# EAGLE design i2c_bargraph (EAGLE 7.4.0)
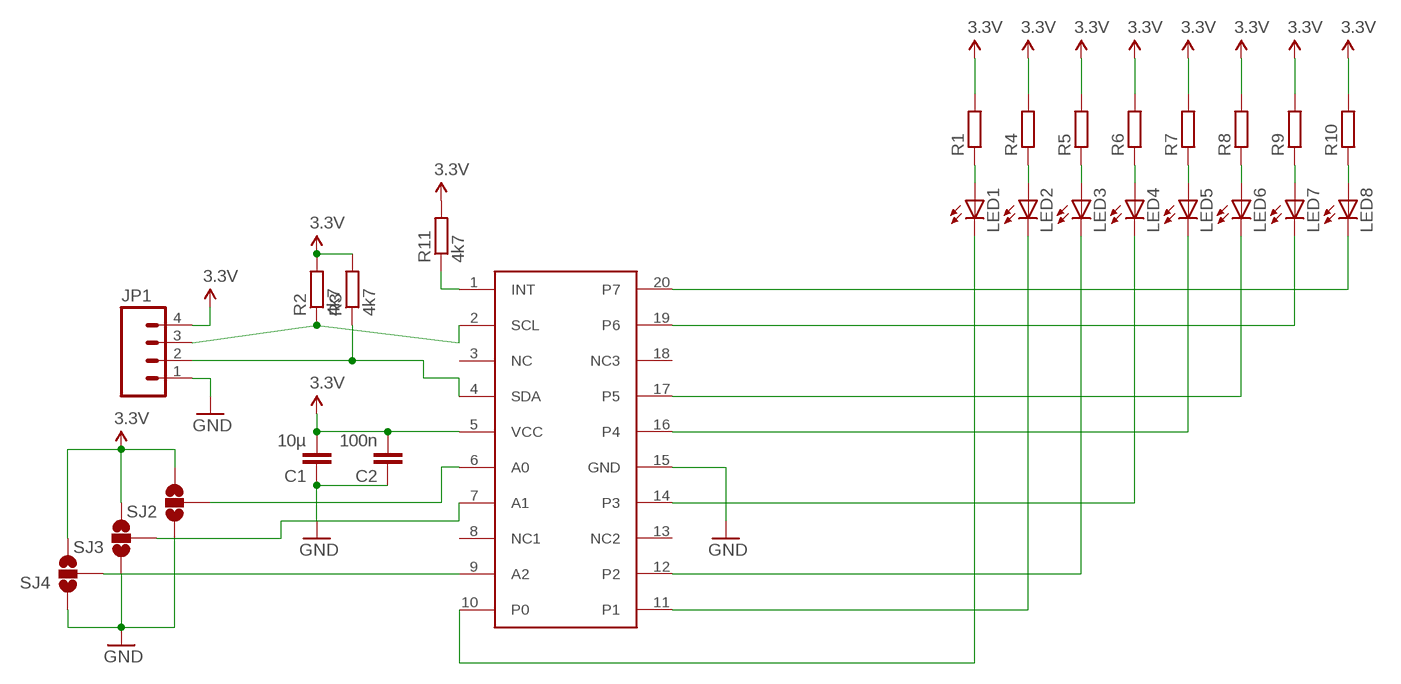
[diagram p0: schematic, sheet 1]

## Parts
C1  10µ  C-EUC0603  [C0603]
C2  100n  C-EUC0603  [C0603]
JP1  M04PTH  [1X04]
LED1  LEDCHIP-LED0805  [CHIP-LED0805]
LED2  LEDCHIP-LED0805  [CHIP-LED0805]
LED3  LEDCHIP-LED0805  [CHIP-LED0805]
LED4  LEDCHIP-LED0805  [CHIP-LED0805]
LED5  LEDCHIP-LED0805  [CHIP-LED0805]
LED6  LEDCHIP-LED0805  [CHIP-LED0805]
LED7  LEDCHIP-LED0805  [CHIP-LED0805]
LED8  LEDCHIP-LED0805  [CHIP-LED0805]
R1  R-EU_R0603  [R0603]
R2  4k7  R-EU_R0603  [R0603]
R3  4k7  R-EU_R0603  [R0603]
R4  R-EU_R0603  [R0603]
R5  R-EU_R0603  [R0603]
R6  R-EU_R0603  [R0603]
R7  R-EU_R0603  [R0603]
R8  R-EU_R0603  [R0603]
R9  R-EU_R0603  [R0603]
R10  R-EU_R0603  [R0603]
R11  4k7  R-EU_R0603  [R0603]
SJ2  SOLDERJUMPER_2WAY-OLDS  [SJ_3]
SJ3  SOLDERJUMPER_2WAY-OLDS  [SJ_3]
SJ4  SOLDERJUMPER_2WAY-OLDS  [SJ_3]
U$1  PCF8574TSSOP  [TSSOP20]

## Nets
3.3V: C1.2 C2.2 JP1.4 R1.2 R2.2 R3.2 R4.2 R5.2 R6.2 R7.2 R8.2 R9.2 R10.2 R11.2 SJ2.3 SJ3.3 SJ4.3 U$1.5(VCC)
GND: C1.1 C2.1 JP1.1 SJ2.1 SJ3.1 SJ4.1 U$1.15(GND)
N$1: JP1.3 R2.1 U$1.2(SCL)
N$2: JP1.2 R3.1 U$1.4(SDA)
N$3: R11.1 U$1.1(INT)
N$4: LED1.A R1.1
N$5: LED2.A R4.1
N$6: LED3.A R5.1
N$7: LED4.A R6.1
N$8: LED5.A R7.1
N$9: LED6.A R8.1
N$10: LED7.A R9.1
N$11: LED8.A R10.1
N$12: LED1.C U$1.10(P0)
N$13: LED2.C U$1.11(P1)
N$14: LED3.C U$1.12(P2)
N$15: LED4.C U$1.14(P3)
N$16: LED5.C U$1.16(P4)
N$17: LED6.C U$1.17(P5)
N$18: LED7.C U$1.19(P6)
N$19: LED8.C U$1.20(P7)
N$21: SJ4.2 U$1.9(A2)
N$22: SJ3.2 U$1.7(A1)
N$23: SJ2.2 U$1.6(A0)
Unconnected: U$1.3(NC) U$1.8(NC1) U$1.13(NC2) U$1.18(NC3)

## Library data of the parts
C1 C2 = rcl:C-EU: CAPACITOR, European symbol
JP1 = SparkFun-Connectors:M04: Header 4 Standard 4-pin 0.1" header. Use with straight break away headers (SKU : PRT-00116), right angle break away headers (PRT-00553), swiss pins (PRT-00743), machine pins (PRT-00117), and female headers (PRT-00115). Molex polarized connector foot print use with SKU : PRT-08231 with associated crimp pins and housings. 1MM SMD Version SKU: PRT-10208
LED1-LED8 = adafruit:LED: LED OSRAM: - CHIPLED LG R971, LG N971, LY N971, LG Q971, LY Q971, LO R971, LY R971 LH N974, LH R974 LS Q976, LO Q976, LY Q976 LO Q996 - Hyper CHIPLED LW Q18S LB Q993, LB Q99A, LB R99A - SideLED LS A670, LO A670, LY A670, LG A670, LP A670 LB A673, LV A673, LT A673, LW A673 LH A674 LY A675 LS A676, LA A676, LO A676, LY A676, LW A676 LS A679, LY A679, LG A679 - Hyper Micro SIDELED® LS Y876, LA Y876, LO Y876, LY Y876 LT Y87S - SmartLED LW L88C, LW L88S LB L89C, LB L89S, LG L890 LS L89K, LO L89K, LY L89K LS L896, LA L896, LO L896, LY L896 - TOPLED LS T670, LO T670, LY T670, LG T670, LP T670 LSG T670, LSP T670, LSY T670, LOP T670, LYG T670 LG T671, LOG T671, LSG T671 LB T673, LV T673, LT T673, LW T673 LH T674 LS T676, LA T676, LO T676, LY T676, LB T676, LH T676, LSB T676, LW T676 LB T67C, LV T67C, LT T67C, LS T67K, LO T67K, LY T67K, LW E67C LS E67B, LA E67B, LO E67B, LY E67B, LB E67C, LV E67C, LT E67C LW T67C LS T679, LY T679, LG T679 LS T770, LO T770, LY T770, LG T770, LP T770 LB T773, LV T773, LT T773, LW T773 LH T774 LS E675, LA E675, LY E675, LS T675 LS T776, LA T776, LO T776, LY T776, LB T776 LHGB T686 LT T68C, LB T68C - Hyper Mini TOPLED® LB M676 - Mini TOPLED Santana® LG M470 LS M47K, LO M47K, LY M47K Source: http://www.osram.convergy.de/
R1-R11 = rcl:R-EU_: RESISTOR, European symbol
SJ2-SJ4 = SparkFun-Retired:SOLDERJUMPER_2WAY-OLD: Solder Jumper 2 way solder jumper
U$1 = PFC8574Tssop:PCF8574TSSOP

## Board
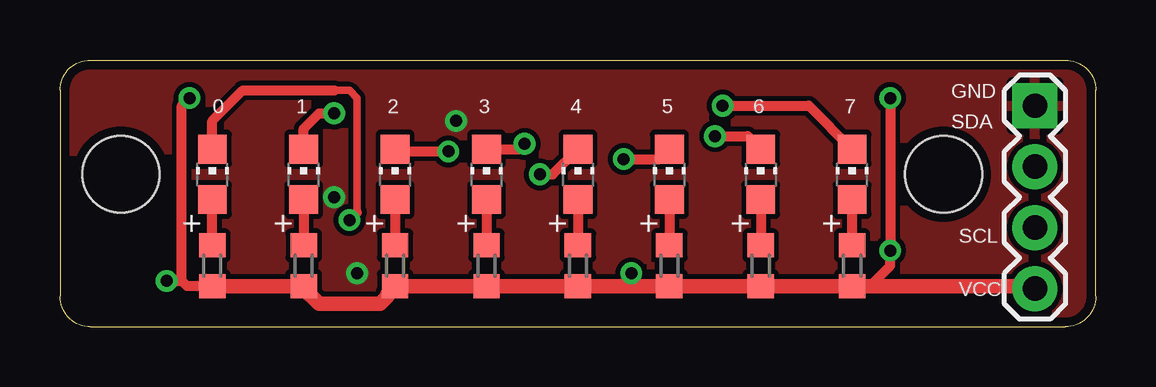
[diagram p1: board, top side]
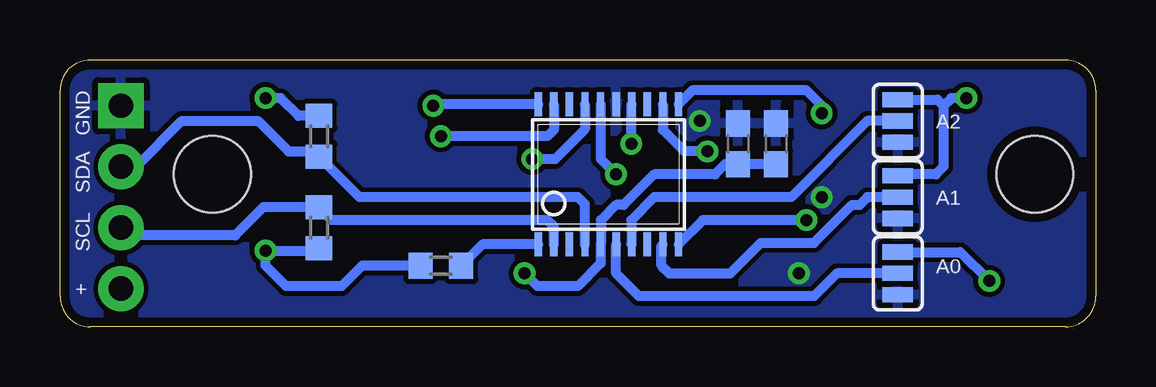
[diagram p2: board, bottom side, seen from below]

Size 43.18 x 11.11 mm. Coordinates in mm from the lower left corner, seen from the top.
Outline: 1.27,0 41.91,0 arc90 43.18,1.27 43.18,9.84 arc90 41.91,11.11 1.27,11.11 arc90 0,9.84 0,1.27 arc90 1.27,0
Copper layers (1*16): Top 0.035mm / dielectric 1.5mm / Bottom 0.035mm
Design rules "default *": minimum track width 10mil, minimum drill 24mil, track to track 8mil, track to pad 8mil, pad to pad 8mil, via to via 8mil, smd to smd 8mil, copper to edge 15mil, drill to drill 8mil, minimum pad ring 10mil, minimum via ring 8mil, stop-mask expansion 4mil, vias tented up to drill 20mil, thermal gap 10mil
Holes 3.2 mm at 2.54,6.35 36.83,6.35

### Footprints (pad centres in the part's own frame; a part is rotated, then mirrored left to right if it is on the bottom)
C0603 = smd 1.1 x 1: 1 -0.85,0; 2 0.85,0
1X04 = drill 1.016 pad 1.88 square: 1 0,0 | drill 1.016 pad 1.88: 2 2.54,0; 3 5.08,0; 4 7.62,0
CHIP-LED0805 = smd 1.2 x 1.2: A 0,-1.05; C 0,1.05
R0603 = smd 1 x 1.1: 1 -0.85,0; 2 0.85,0
SJ_3 = smd 0.635 x 1.27: 1 -0.889,0; 2 0,0; 3 0.889,0
TSSOP20 = smd 0.305 x 0.991: 1 -2.925,-2.918; 2 -2.275,-2.918; 3 -1.625,-2.918; 4 -0.975,-2.918; 5 -0.325,-2.918; 6 0.325,-2.918; 7 0.975,-2.918; 8 1.625,-2.918; 9 2.275,-2.918; 10 2.925,-2.918; 11 2.925,2.918; 12 2.275,2.918; 13 1.625,2.918; 14 0.975,2.918; 15 0.325,2.918; 16 -0.325,2.918; 17 -0.975,2.918; 18 -1.625,2.918; 19 -2.275,2.918; 20 -2.925,2.918

### Placement (x,y rotation side)
C1  14.92,7.62 270 bottom
C2  13.34,7.62 270 bottom
JP1  40.64,9.21 270 top
LED1  6.35,6.35 0 top
LED2  10.16,6.35 0 top
LED3  13.97,6.35 0 top
LED4  17.78,6.35 0 top
LED5  21.59,6.35 0 top
LED6  25.4,6.35 0 top
LED7  29.21,6.35 0 top
LED8  33.02,6.35 0 top
R1  6.35,2.54 270 top
R2  32.38,4.13 270 bottom
R3  32.38,7.94 90 bottom
R4  10.16,2.54 270 top
R5  13.97,2.54 270 top
R6  17.78,2.54 270 top
R7  21.59,2.54 270 top
R8  25.4,2.54 270 top
R9  29.21,2.54 270 top
R10  33.02,2.54 270 top
R11  27.3,2.54 180 bottom
SJ2  8.26,2.22 90 bottom
SJ3  8.26,8.57 90 bottom
SJ4  8.26,5.4 90 bottom
U$1  20.32,6.35 0 bottom

### Tracks (layer width: path | path; a pad name or v marks a point on that pad's centre or on a via)
3.3V  (via drill 0.5)
  Top 0.406: v34.61,9.53 v34.61,3.17 34.61,2.54 33.76,1.69 R10.2 | v23.81,2.22 23.81,1.69 | R1.2 5.29,1.69 5.08,1.91 | 5.08,1.91 5.08,9.21 v5.4,9.53 | v4.45,1.91 5.08,1.91
  Top 0.61: R1.2 R4.2 10.16,1.59 10.79,0.95 13.34,0.95 13.65,1.27 13.65,1.37 R5.2 R6.2 R7.2 23.81,1.69 R8.2 R9.2 R10.2 40.54,1.69 JP1.4
  Bottom 0.406: SJ3.3 6.6,9.46 6.35,9.21 | 6.35,9.21 6.35,6.67 6.67,6.35 8.19,6.35 SJ4.3 | SJ2.3 5.65,3.11 v4.45,1.91 | C1.2 C2.2 15.46,6.77 15.88,6.35 18.41,6.35 19.68,5.08 20,5.08 20.64,4.45 U$1.5 20.64,2.63 R7.2 23.28,1.69 v23.81,2.22 | R3.2 33.23,8.79 33.97,9.53 v34.61,9.53 | R2.2 32.49,3.17 v34.61,3.17 34.61,2.54 33.76,1.69 31.43,1.69 30.58,2.54 R11.2 | 6.35,9.21 6.03,9.53 v5.4,9.53
GND  (via drill 0.5)
  other vias: 16.51,8.57 11.43,5.4 12.38,2.22
  pour Top: -0.95,12.06 -0.95,-0.95 44.13,-0.95 44.13,12.06
  pour Bottom: -0.32,11.75 -0.32,-0.32 43.5,-0.32 43.5,11.75
N$1
  Bottom 0.406: U$1.2 22.59,4.18 22.86,4.45 31.85,4.45 R2.1 34.71,4.98 35.88,3.81 40.32,3.81 JP1.3
N$2
  Bottom 0.406: U$1.4 21.3,5.1 21.59,5.4 30.7,5.4 R3.1 32.6,7.3 33.65,7.3 34.92,8.57 38.1,8.57 40,6.67 JP1.2
N$3
  Bottom 0.406: U$1.1 25.56,3.43 R11.1
N$4
  Top 0.406: R1.1 LED1.A
N$5
  Top 0.406: LED2.A R4.1
N$6
  Top 0.406: LED3.A R5.1
N$7
  Top 0.406: LED4.A R6.1
N$8
  Top 0.406: LED5.A R7.1
N$9
  Top 0.406: LED6.A R8.1
N$10
  Top 0.406: LED7.A R9.1
N$11
  Top 0.406: LED8.A R10.1
N$12  (via drill 0.5)
  Top 0.305: 12.38,4.76 12.38,9.53 12.07,9.84 11.43,9.84
  Top 0.406: LED1.C 6.35,8.57 7.62,9.84 11.43,9.84 | 12.38,4.76 v12.07,4.45
  Bottom 0.406: v12.07,4.45 16.38,4.45 U$1.10
N$13  (via drill 0.5)
  Top 0.406: LED2.C 10.16,8.26 10.79,8.89 v11.43,8.89
  Bottom 0.406: U$1.11 16.82,9.84 12.07,9.84 11.43,9.21 v11.43,8.89
N$14  (via drill 0.5)
  Top 0.406: LED3.C 14.07,7.3 v16.19,7.3
  Bottom 0.406: U$1.12 18.05,8.2 17.14,7.3 v16.19,7.3
N$15  (via drill 0.5)
  Top 0.406: LED4.C 19.15,7.4 v19.37,7.62
  Bottom 0.406: v19.37,7.62 19.37,9.24 U$1.14
N$16  (via drill 0.5)
  Top 0.406: v20,6.35 20.54,6.35 LED5.C
  Bottom 0.406: U$1.16 20.64,6.99 v20,6.35
N$17  (via drill 0.5)
  Top 0.406: v23.5,6.99 24.98,6.99 LED6.C
  Bottom 0.406: U$1.17 21.3,8.23 22.54,6.99 v23.5,6.99
N$18  (via drill 0.5)
  Top 0.406: v27.3,7.94 28.67,7.94 LED7.C
  Bottom 0.406: U$1.19 22.59,8.2 22.86,7.94 v27.3,7.94
N$19  (via drill 0.5)
  Top 0.406: v27.62,9.21 31.21,9.21 LED8.C
  Bottom 0.406: U$1.20 27.56,9.27 v27.62,9.21
N$21
  Bottom 0.406: SJ4.2 9.53,5.4 9.84,5.08 10.16,5.08 11.75,3.49 13.97,3.49 15.24,2.22 17.78,2.22 18.1,2.54 18.1,3.38 U$1.9
N$22
  Bottom 0.406: SJ3.2 9.53,8.57 12.7,5.4 18.41,5.4 19.37,4.45 19.37,3.46 U$1.7
N$23
  Bottom 0.406: U$1.6 20,2.22 19.05,1.27 11.75,1.27 10.79,2.22 SJ2.2

### Text on the board
tPlace: GND | 0 | 1 | 2 | 3 | 4 | 5 | 6 | 7 | SDA | SCL | VCC
bPlace: GND | A2 | SDA | A1 | SCL | A0 | +